# Altium schematic sheet 电源板.SchDoc: 阿波罗简易型控制器电源板
size A4; Revision: V1.2
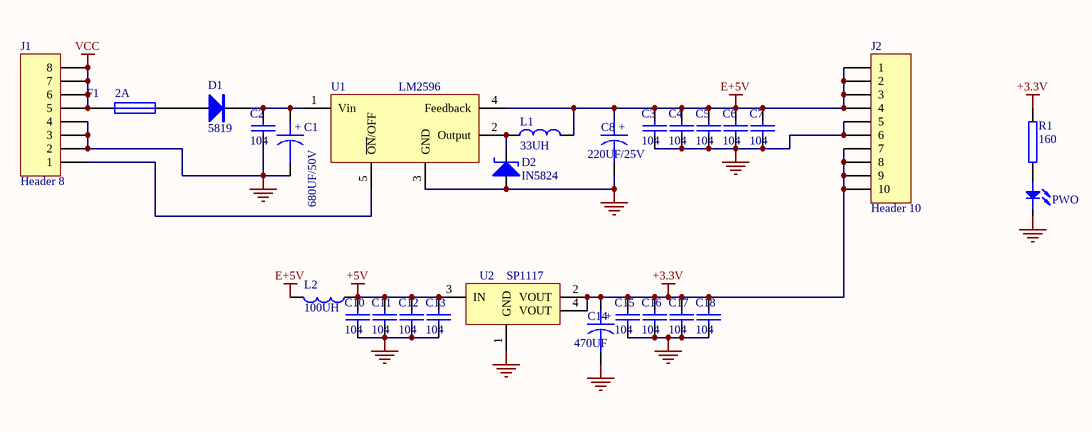
[diagram p0: 电源板.SchDoc]

## Parts
C1  680UF/50V  [固态电容]
C2  104  [0603A]
C3  104  [0603A]
C4  104  [0603A]
C5  104  [0603A]
C6  104  [0603A]
C7  104  [0603A]
C8  220UF/25V  [固态电容]
C10  104  [0603A]
C11  104  [0603A]
C12  104  [0603A]
C13  104  [0603A]
C14  470UF  [固态电容]
C15  104  [0603A]
C16  104  [0603A]
C17  104  [0603A]
C18  104  [0603A]
D1  5819  [贴片二极管]
D2  IN5824  [贴片二极管]
F1  2A  [自恢复保险丝 - duplicate]
J1  Header 8  [2.0排针2X4]
J2  Header 10  [2.0排针2X10]
L1  33UH  [SMD-100]
L2  100UH  [1206C]
PWO  LED  [SMDLED]  (value not drawn)
R1  160  [0603A]
U1  LM2596  [TO-263-5]
U2  SP1117  [SOT223]

## Nets
+3.3V: C14.1 C15.1 C16.1 C17.1 C18.1 J2.7 J2.8 J2.9 J2.10 R1.1 U2.2(VOUT) U2.4(VOUT)
+5V: C10.1 C11.1 C12.1 C13.1 L2.2 U2.3(IN)
E+5V: C3.2 C4.2 C5.2 C6.2 C7.2 C8.1 J2.1 J2.2 J2.3 J2.4 L1.1 L2.1 U1.4(Feedback)
GND: C1.2 C2.1 C3.1 C4.1 C5.1 C6.1 C7.1 C8.2 C10.2 C11.2 C12.2 C13.2 C14.2 C15.2 C16.2 C17.2 C18.2 D2.A J1.2 J1.3 J1.4 J2.5 J2.6 PWO.K U1.3(GND) U2.1(GND)
VCC: F1.1 J1.5 J1.6 J1.7 J1.8
NetC1_1: C1.1 C2.2 D1.K U1.1(Vin)
NetD1_A: D1.A F1.2
NetD2_K: D2.K L1.2 U1.2(Output)
NetJ1_1: J1.1 U1.5(~{ON}/OFF)
NetPWO_A: PWO.A R1.2

## Notes on the sheet
- (in symbol CAPACITOR POL) +

## Library data of the parts
C1 C8 C14 = CAPACITOR POL: Capacitor
C2-C7 C10-C13 C15-C18 = CAP: Capacitor
D1 = 二极管
D2 = 肖特基二极管
F1 = Fuse 1: Fuse; Published: 8-Jun-2000; LatestRevisionDate: 17-Jul-2002; LatestRevisionNote: Re-released for DXP Platform.; PackageReference: PIN-W2/E2.8; Publisher: Altium Limited
J1 = Header 8: Header, 8-Pin; LatestRevisionDate: 17-Jul-2002; LatestRevisionNote: Re-released for DXP Platform.; Publisher: Altium Limited
J2 = Header 10: Header, 10-Pin; LatestRevisionDate: 17-Jul-2002; LatestRevisionNote: Re-released for DXP Platform.; Publisher: Altium Limited
L1 L2 = L1
R1 = RES2